# EAGLE schematic RC Kill Switch (EAGLE 5.11)
BOM: EXCLUDE; DATABASE: ./../PARTSDB.txt; PARTNO: GRM188F51A475ZE20D
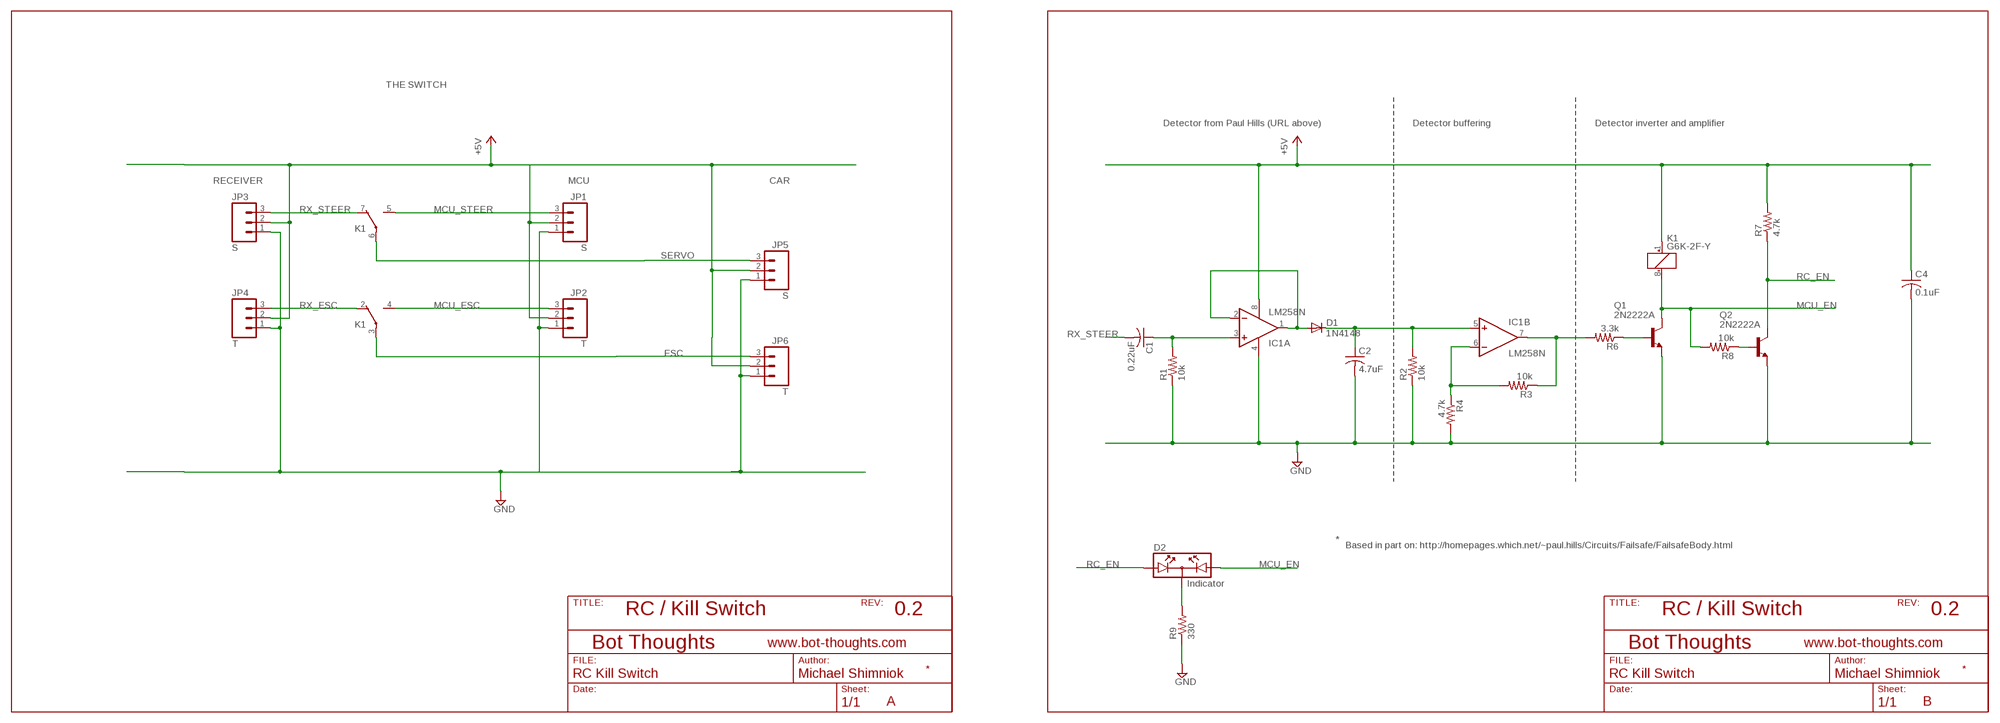
[diagram p0: schematic, sheet 1]

## Parts
C1  0.22uF  C-USC0603  [C0603]
C2  4.7uF  C-USC0603  [C0603]
C4  0.1uF  C-USC0603  [C0603]
D1  1N4148  DIODE-SOD123  [SOD123]
D2  Indicator  DUOLED  [DUOLED]
IC1  LM258N  LM1458D  [SO08]
JP1  S  M03PTH  [1X03]
JP2  T  M03PTH  [1X03]
JP3  S  M03PTH  [1X03]
JP4  T  M03PTH  [1X03]
JP5  S  M03PTH  [1X03]
JP6  T  M03PTH  [1X03]
K1  G6K-2F-Y  [G6K-2F-Y]
Q1  2N2222A  2N3904SMD  [SOT-23]
Q2  2N2222A  2N3904SMD  [SOT-23]
R1  10k  R-US_R0603  [R0603]
R2  10k  R-US_R0603  [R0603]
R3  10k  R-US_R0603  [R0603]
R4  4.7k  R-US_R0603  [R0603]
R6  3.3k  R-US_R0603  [R0603]
R7  4.7k  R-US_R0603  [R0603]
R8  10k  R-US_R0603  [R0603]
R9  330  R-US_R0603  [R0603]

## Nets
+5V: C4.1 IC1.8(P:V+) JP1.2 JP2.2 JP3.2 JP4.2 JP5.2 JP6.2 K1.1(1:+) R7.2
ESC: JP6.3 K1.3(2:P)
GND: C2.2 C4.2 IC1.4(P:V-) JP1.1 JP2.1 JP3.1 JP4.1 JP5.1 JP6.1 Q1.2(E) Q2.2(E) R1.1 R2.1 R4.2 R9.1
MCU_EN: D2.A2 K1.8(1:-) Q1.1(C) R8.2
MCU_ESC: JP2.3 K1.4(2:S)
MCU_STEER: JP1.3 K1.5(3:S)
N$1: D1.A IC1.1(A:OUT) IC1.2(A:-IN)
N$2: C2.1 D1.C IC1.5(B:+IN) R2.2
N$3: IC1.6(B:-IN) R3.2 R4.1
N$4: IC1.7(B:OUT) R3.1 R6.2
N$5: C1.1 IC1.3(A:+IN) R1.2
N$6: D2.K R9.2
N$7: Q2.3(B) R8.1
N$8: Q1.3(B) R6.1
RC_EN: D2.A1 Q2.1(C) R7.1
RX_ESC: JP4.3 K1.2(2:O)
RX_STEER: C1.2 JP3.3 K1.7(3:O)
SERVO: JP5.3 K1.6(3:P)

## Notes on the sheet
- THE SWITCH
- Detector from Paul Hills (URL above) | Detector buffering | Detector inverter and amplifier
- RECEIVER | MCU | CAR
- *
- Based in part on: http://homepages.which.net/~paul.hills/Circuits/Failsafe/FailsafeBody.html
- RC / Kill Switch | 0.2 | RC / Kill Switch | 0.2
- * | *
- A | B

## Library data of the parts
C1 C2 C4 = rcl:C-US: CAPACITOR, American symbol
D1 = diode:DIODE-: DIODE
D2 = special:DUOLED: Duo LED
IC1 = linear:*1458: OP AMP
JP1-JP6 = SparkFun:M03: Header 3 Standard 3-pin 0.1" header. Use with straight break away headers (SKU : PRT-00116), right angle break away headers (PRT-00553), swiss pins (PRT-00743), machine pins (PRT-00117), and female headers (PRT-00115). Molex polarized connector foot print use with SKU : PRT-08232 with associated crimp pins and housings.
K1 = relay:G6K: Low Signal Relay oeiwcsnts1.omron.com/.. D20G6K0100.pdf; MF: OMRON COMPONENTS USA; MPN: G6K-2F-Y DC3; OC_FARNELL: 1690316; OC_NEWARK: 89C6451
Q1 Q2 = mes:2N3904: NPN Transistor Small signal NPN Bipolar Junction Transistor (BJT). Use this device to represent any of a number of such transistors with similar package and pinout: 2N4401, 2N3904, 2N2222, etc.
R1-R4 R6-R9 = rcl:R-US_: RESISTOR, American symbol